# EAGLE design main_module (EAGLE 7.7.0)
CO2 Monitor main board
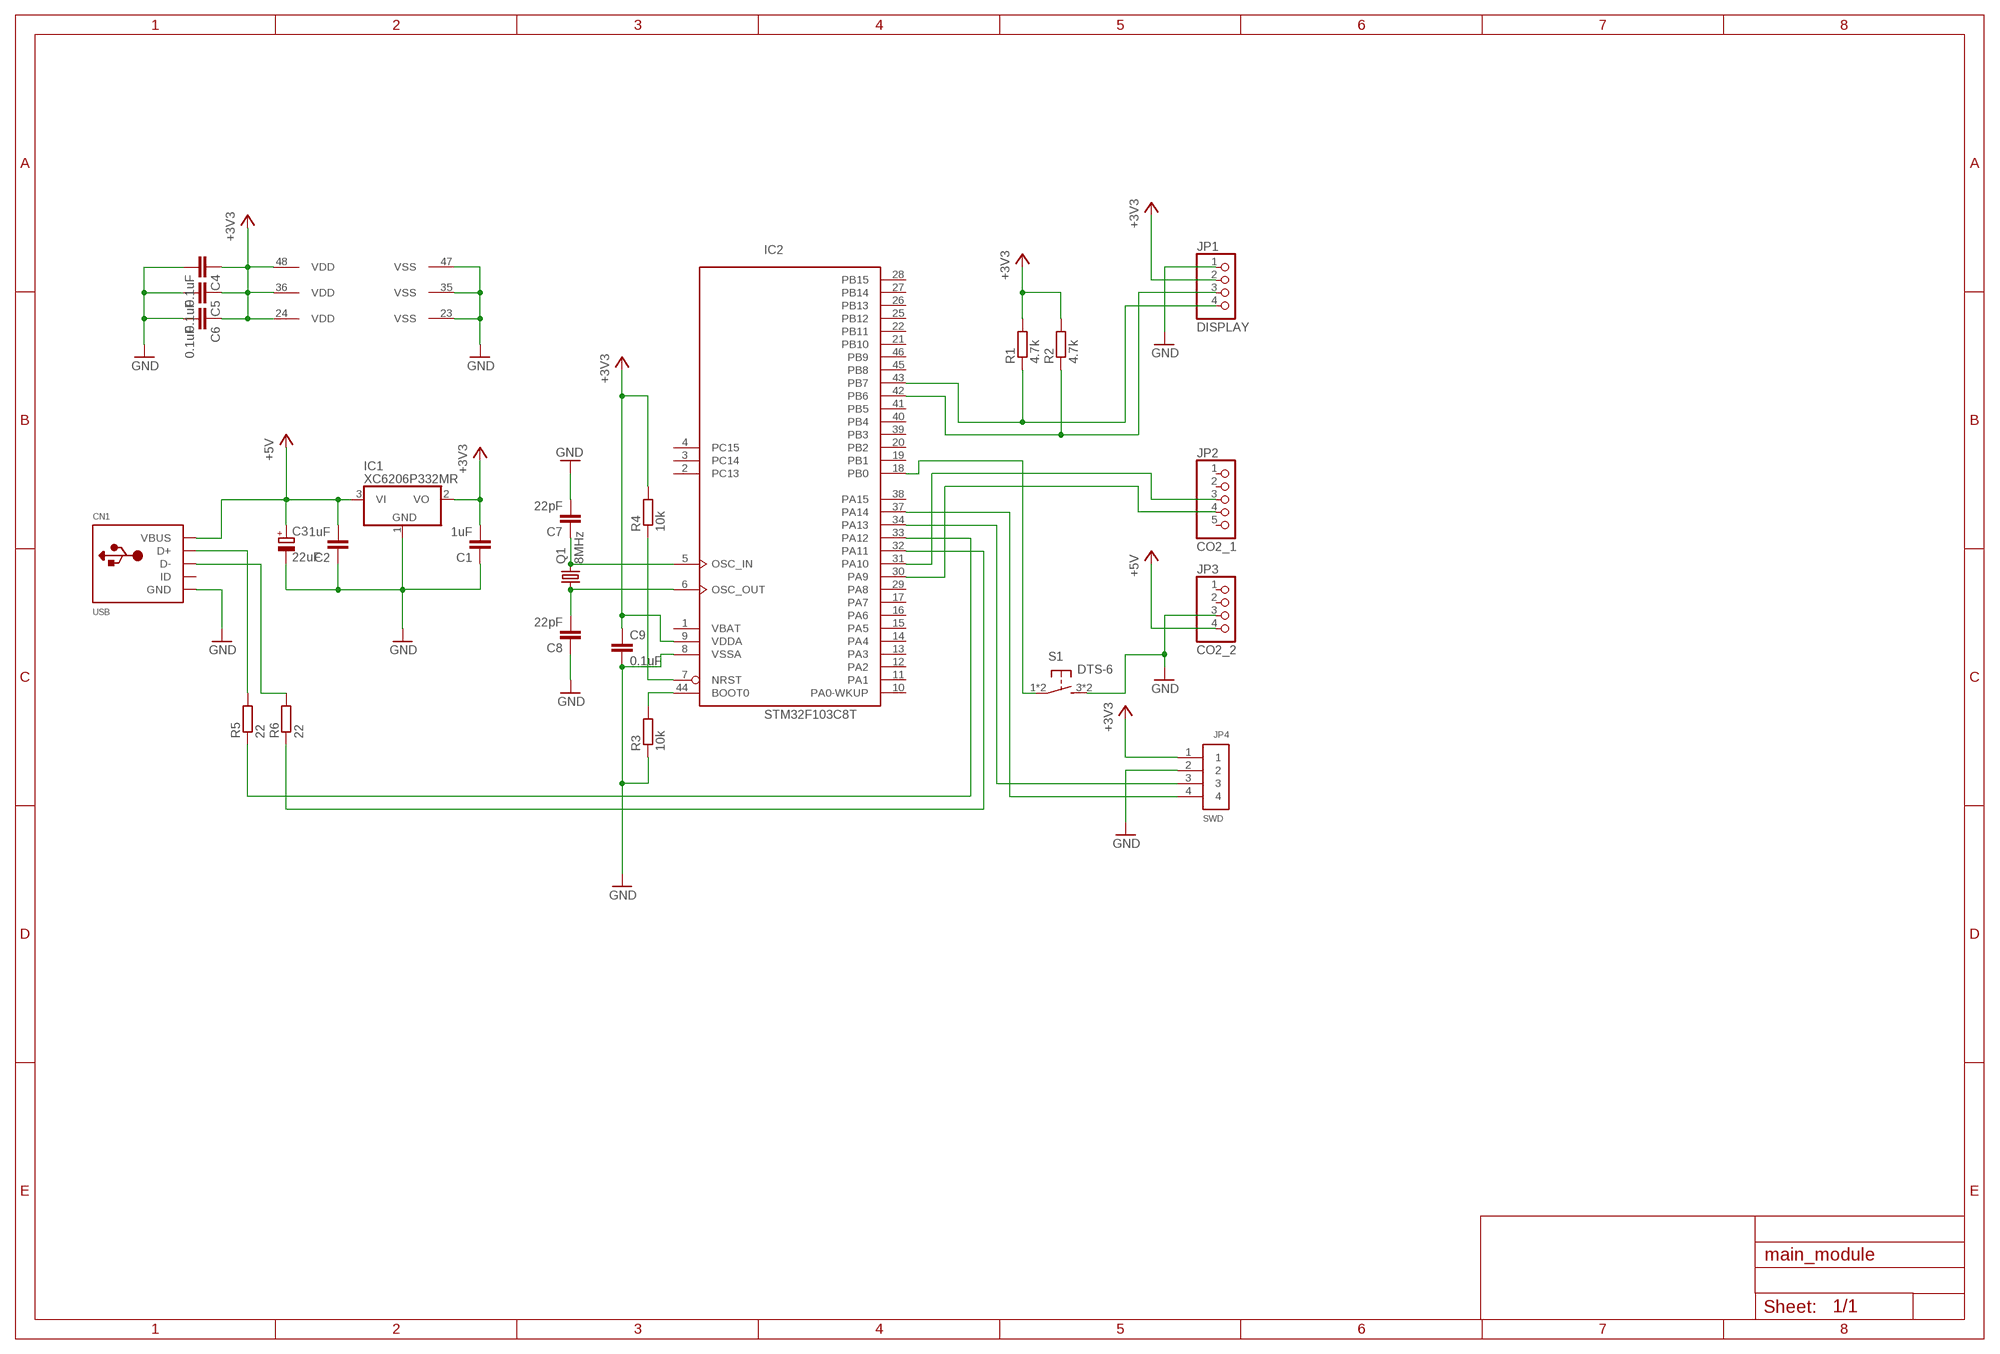
[diagram p0: schematic, sheet 1]

## Parts
C1  1uF  C-EUC0805  [C0805]
C2  1uF  C-EUC0805  [C0805]
C3  22uF  CPOL-EUC/6032-28R  [C/6032-28R]
C4  0.1uF  C-EUC0805  [C0805]
C5  0.1uF  C-EUC0805  [C0805]
C6  0.1uF  C-EUC0805  [C0805]
C7  22pF  C-EUC0805  [C0805]
C8  22pF  C-EUC0805  [C0805]
C9  0.1uF  C-EUC0805  [C0805]
CN1  USB  USBMINIB  [USB-MINIB]
IC1  XC6206P332MR  MCP1703CB  [SOT23]
IC2  STM32F103C8T  [LQFP48]
JP1  DISPLAY  PINHD-1X4  [1X04]
JP2  CO2_1  PINHD-1X5  [1X05]
JP3  CO2_2  PINHD-1X4  [1X04]
JP4  SWD  1X4-BIG  [1X04-BIG]
Q1  8MHz  CRYSTALHC49UP  [HC49UP]
R1  4.7k  R-EU_R0805  [R0805]
R2  4.7k  R-EU_R0805  [R0805]
R3  10k  R-EU_R0805  [R0805]
R4  10k  R-EU_R0805  [R0805]
R5  22  R-EU_R0805  [R0805]
R6  22  R-EU_R0805  [R0805]
S1  DTS-6  [DTS-6]

## Nets
+3V3: C1.2 C4.1 C5.1 C6.1 C9.1 IC1.2(VO) IC2.9(VDDA) IC2.24(VDD) IC2.36(VDD) IC2.48(VDD) JP1.2 JP4.1 R1.2 R2.2 R4.2
+5V: C2.2 C3.+ CN1.VBUS IC1.3(VI) JP3.4
GND: C1.1 C2.1 C3.- C4.2 C5.2 C6.2 C7.2 C8.1 C9.2 CN1.GND IC1.1(GND) IC2.8(VSSA) IC2.23(VSS) IC2.35(VSS) IC2.47(VSS) JP1.1 JP3.3 JP4.2 R3.1 S1.3 S1.4
N$1: C7.1 IC2.5(OSC_IN) Q1.2
N$2: IC2.44(BOOT0) R3.2
N$3: IC2.18(PB0) S1.1 S1.2
N$4: C8.2 IC2.6(OSC_OUT) Q1.1
N$5: IC2.7(NRST) R4.1
N$12: CN1.D+ R5.2
N$13: CN1.D- R6.2
RX: IC2.31(PA10) JP2.3
SCL: IC2.42(PB6) JP1.3 R2.1
SDA: IC2.43(PB7) JP1.4 R1.1
SWCLK: IC2.37(PA14) JP4.4
SWDIO: IC2.34(PA13) JP4.3
TX: IC2.30(PA9) JP2.4
USB_DM: IC2.32(PA11) R6.1
USB_DP: IC2.33(PA12) R5.1
Unconnected: CN1.ID IC2.2(PC13) IC2.3(PC14) IC2.4(PC15) IC2.10(PA0-WKUP) IC2.11(PA1) IC2.12(PA2) IC2.13(PA3) IC2.14(PA4) IC2.15(PA5) IC2.16(PA6) IC2.17(PA7) IC2.19(PB1) IC2.20(PB2) IC2.21(PB10) IC2.22(PB11) IC2.25(PB12) IC2.26(PB13) IC2.27(PB14) IC2.28(PB15) IC2.29(PA8) IC2.38(PA15) IC2.39(PB3) IC2.40(PB4) IC2.41(PB5) IC2.45(PB8) IC2.46(PB9) JP2.1 JP2.2 JP2.5 JP3.1 JP3.2

## Power pins joined to a net without a drawn wire
VBAT: IC2.1(VBAT)

## Library data of the parts
C1 C2 C4-C9 = resistor:C-EU: CAPACITOR, European symbol
C3 = resistor:CPOL-EU: POLARIZED CAPACITOR, European symbol
CN1 = adafruit:USB: USB Connectors USBMINIB - Surface Mount Female Mini-B USB Connector 4UConnector: 06564 By microbuilder.eu Thru-hole RA Female Mini-B USB Connector 4UConnector: 18732 By ladyada.net
IC1 = linear:MCP1703: 250 mA, 16V, Low Quiescent Current LDO Regulator Source: http://ww1.microchip.com/downloads/en/DeviceDoc/22049b.pdf
IC2 = micro-stm_v3:STM32F103C*T: ARM 32-bit Cortex™-M3 CPU 72 MHz maximum frequency 16 to 128 Kbytes of Flash memory 6 to 20 kbytes of SRAM 37 GPIOs 2.0 to 3.6 V application supply
JP1 JP3 = pinhead:PINHD-1X4: PIN HEADER
JP2 = pinhead:PINHD-1X5: PIN HEADER
JP4 = adafruit:1X4: 4-pin connector
Q1 = crystal:CRYSTAL: CRYSTAL; OC_FARNELL: unknown; OC_NEWARK: unknown
R1-R6 = resistor:R-EU_: RESISTOR, European symbol
S1 = switch-tact:DTS-6

## Net classes
0 default: clearance 0.152 mm
1 power: width 0.508 mm, clearance 0.152 mm to class 0, clearance 0.152 mm

## Board
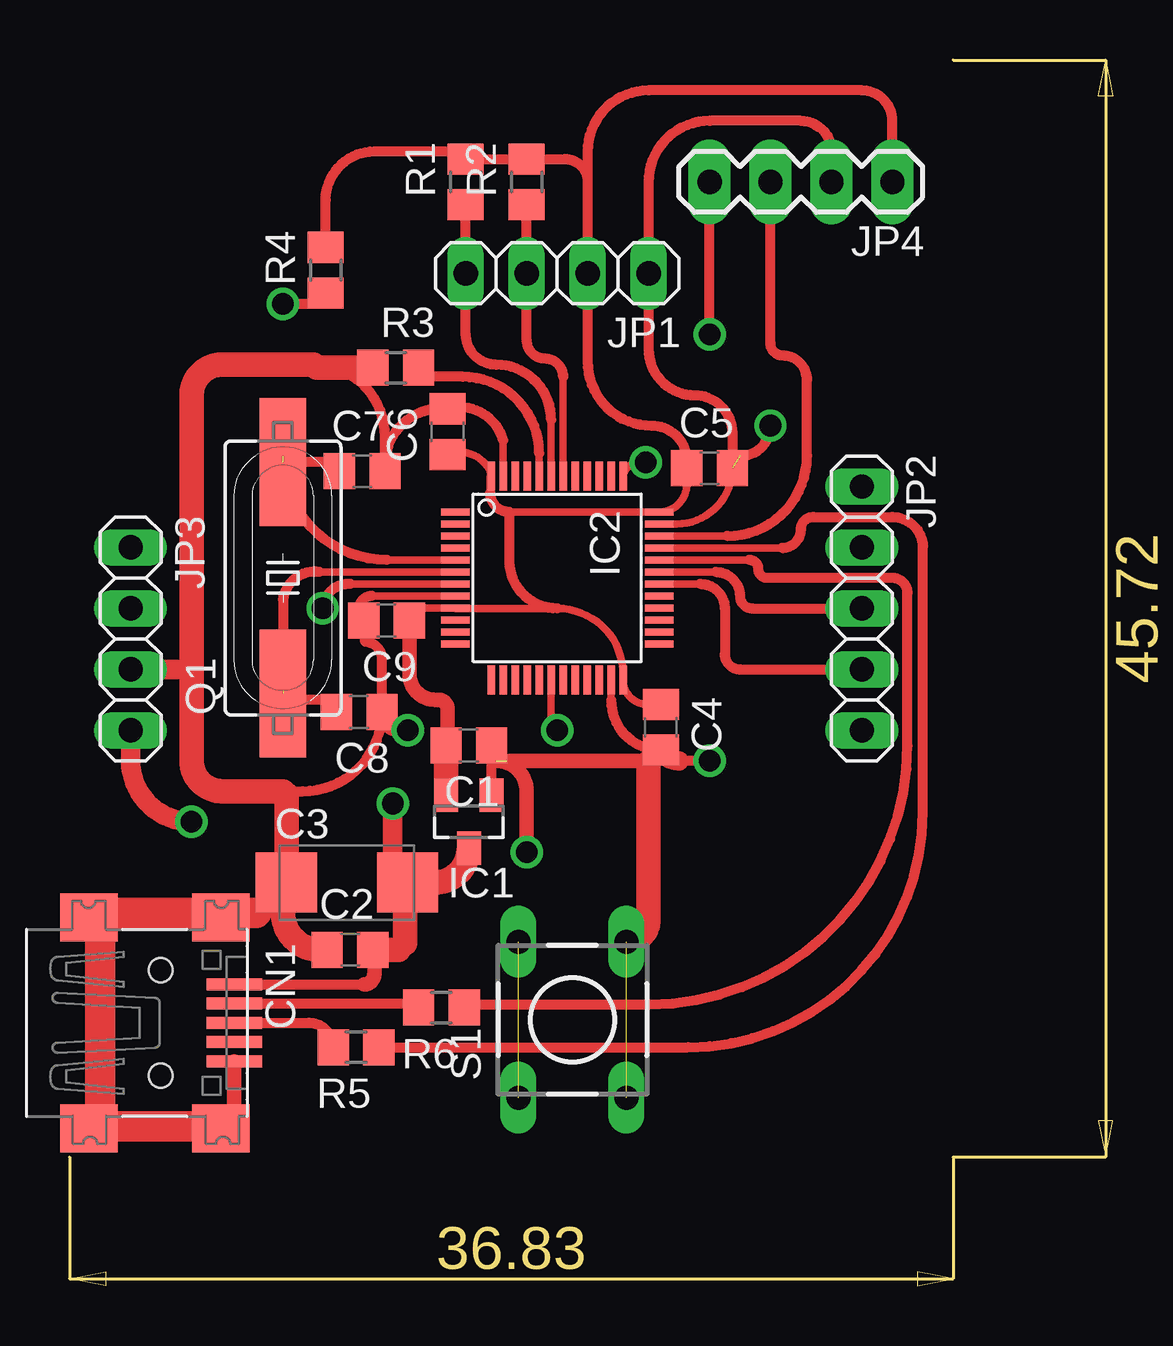
[diagram p1: board, top side]
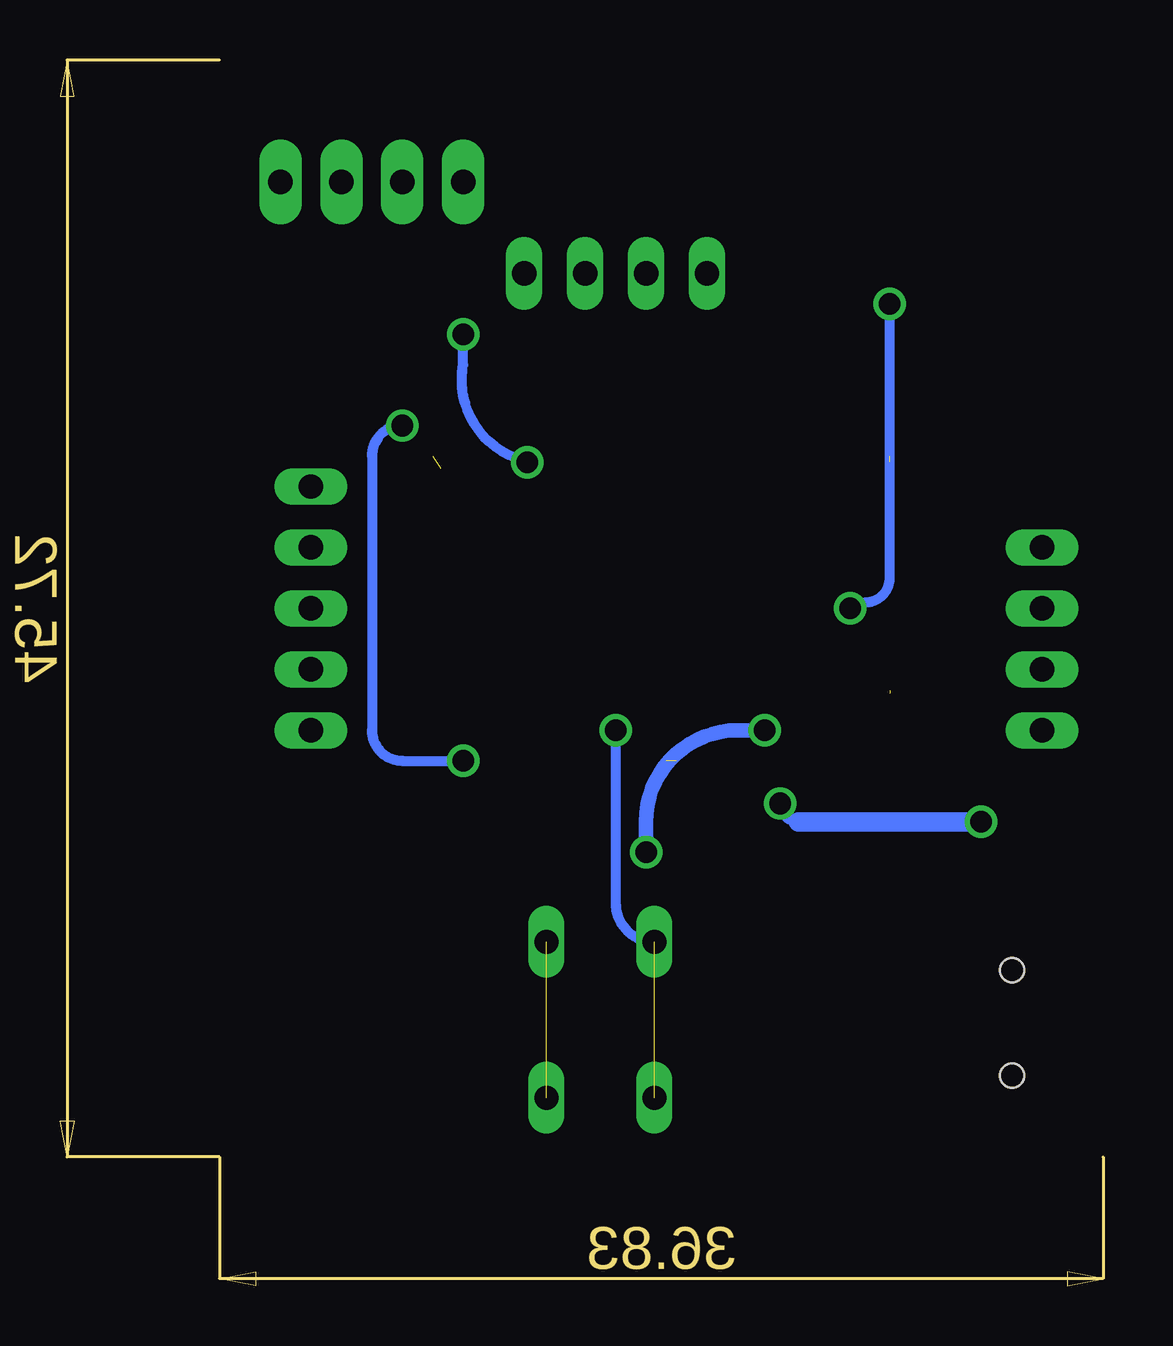
[diagram p2: board, bottom side, seen from below]

Size 43.48 x 51.1 mm. Coordinates in mm from the lower left corner, seen from the top.
Copper layers (1*16): Top 0.035mm / dielectric 1.5mm / Bottom 0.035mm
Design rules "default": minimum track width 10mil, minimum drill 24mil, track to track 8mil, track to pad 8mil, pad to pad 8mil, via to via 8mil, smd to smd 8mil, copper to edge 40mil, drill to drill 8mil, minimum pad ring 10mil, minimum via ring 8mil, stop-mask expansion 4mil, vias tented up to drill 0mil, thermal gap 10mil

### Footprints (pad centres in the part's own frame; a part is rotated, then mirrored left to right if it is on the bottom)
C0805 = smd 1.3 x 1.5: 1 -0.95,0; 2 0.95,0
C/6032-28R = smd 2.55 x 2.5: + 2.525,0; - -2.525,0
USB-MINIB = smd 0.5 x 2.308: D+ 0,4.064; D- -0.8,4.064; GND 1.6,4.064; ID 0.8,4.064; VBUS -1.6,4.064 | smd 2 x 2.4: GND1 -4.4,-2; GND2 -4.4,3.5; GND3 4.4,3.5; GND4 4.4,-2 | hole 1: -2.2,1; 2.2,1
SOT23 = smd 1 x 1.4: 1 -0.95,-1.1; 2 0.95,-1.1; 3 0,1.1
LQFP48 = smd 0.3 x 1.2: 1 -2.75,-4.25; 2 -2.25,-4.25; 3 -1.75,-4.25; 4 -1.25,-4.25; 5 -0.75,-4.25; 6 -0.25,-4.25; 7 0.25,-4.25; 8 0.75,-4.25; 9 1.25,-4.25; 10 1.75,-4.25; 11 2.25,-4.25; 12 2.75,-4.25; 25 2.75,4.25; 26 2.25,4.25; 27 1.75,4.25; 28 1.25,4.25; 29 0.75,4.25; 30 0.25,4.25; 31 -0.25,4.25; 32 -0.75,4.25; 33 -1.25,4.25; 34 -1.75,4.25; 35 -2.25,4.25; 36 -2.75,4.25 | smd 1.2 x 0.3: 13 4.25,-2.75; 14 4.25,-2.25; 15 4.25,-1.75; 16 4.25,-1.25; 17 4.25,-0.75; 18 4.25,-0.25; 19 4.25,0.25; 20 4.25,0.75; 21 4.25,1.25; 22 4.25,1.75; 23 4.25,2.25; 24 4.25,2.75; 37 -4.25,2.75; 38 -4.25,2.25; 39 -4.25,1.75; 40 -4.25,1.25; 41 -4.25,0.75; 42 -4.25,0.25; 43 -4.25,-0.25; 44 -4.25,-0.75; 45 -4.25,-1.25; 46 -4.25,-1.75; 47 -4.25,-2.25; 48 -4.25,-2.75
1X04 = drill 1.016 long: 1 -3.81,0; 2 -1.27,0; 3 1.27,0; 4 3.81,0
1X05 = drill 1.016 long: 1 -5.08,0; 2 -2.54,0; 3 0,0; 4 2.54,0; 5 5.08,0
1X04-BIG = drill 1.016 pad 1.778 long: 1 0,0; 2 2.54,0; 3 5.08,0; 4 7.62,0
HC49UP = smd 5.334 x 1.93: 1 -4.826,0; 2 4.826,0
R0805 = smd 1.3 x 1.5: 1 -0.95,0; 2 0.95,0
DTS-6 = drill 1 long: 1 -3.25,2.25; 2 3.25,2.25; 3 -3.25,-2.25; 4 3.25,-2.25

### Placement (x,y rotation side)
C1  16.64,22.52 180 top
C2  11.68,14.02 0 top
C3  11.56,16.81 0 top
C4  24.64,23.29 270 top
C5  26.67,34.08 0 top
C6  15.75,35.61 90 top
C7  12.19,33.95 0 top
C8  12.06,23.92 180 top
C9  13.21,27.73 180 top
CN1  2.79,10.97 270 top
IC1  16.64,19.35 180 top
IC2  20.32,29.51 270 top
JP1  20.32,42.21 180 top
JP2  33.02,28.24 270 top
JP3  2.54,26.97 270 top
JP4  34.29,46.02 180 top
Q1  8.89,29.51 90 top
R1  16.51,46.02 90 top
R2  19.05,46.02 90 top
R3  13.59,38.27 0 top
R4  10.67,42.34 90 top
R5  11.94,9.95 180 top
R6  15.49,11.6 180 top
S1  20.95,11.09 90 top

### Tracks (layer width: path | path; a pad name or v marks a point on that pad's centre or on a via)
+3V3
  Top 0.305: 25.72,33.41 arc-90 IC2.36 18.33,32.26 | C6.1 arc-90 17.57,33.85 IC2.48 arc90 17.53,33.72 17.53,33.07 | 24.09,24.24 arc-90 IC2.24 23.07,25.49 arc90 20.32,28.24 16.09,28.24 arc-90 IC2.9 14.05,28.26
  Top 0.406: 25.72,33.41 C5.1 25.72,34.4 arc90 24.26,35.86 arc-90 21.59,38.53 JP1.2 | 24.09,24.24 C4.1 | 14.05,28.26 arc90 C9.1 | 17.53,33.07 arc90 18.33,32.26 18.33,30.23 arc90 20.32,28.24 | JP1.2 21.59,46.02 arc90 20.64,46.97 R2.2 R1.2 arc90 16.19,47.29 12.7,47.29 arc90 10.67,45.26 R4.2 | JP4.1 34.29,48.56 arc90 33.02,49.83 24.13,49.83 arc90 21.59,47.29 JP1.2 | 15.24,24.43 15.37,24.43 | 15.75,22.59 arc-90 C1.2
  Top 0.61: C9.1 14.16,25.51 arc90 15.24,24.43 | 15.37,24.43 arc-90 15.75,24.05 15.75,22.59
  Top 1.016: IC1.2 C1.2
+5V  (via drill 0.9)
  Top 0.406: C3.+ 15.2,16.81 | 13.72,14.02 arc90 13.97,14.27 | 13.97,16.7 arc-90 C3.+ | CN1.VBUS 12.27,12.57 | 12.7,13.95 arc90 C2.2 | 13.46,17.43 arc90 C3.+
  Top 0.61: 12.27,12.57 arc90 12.7,13 12.7,13.95
  Top 0.813: JP3.4 2.54,21.89 arc90 v5.08,19.35 | v13.46,20.11 13.46,17.43
  Top 1.016: 15.2,16.81 arc90 IC1.3 | C2.2 13.72,14.02 | 13.97,14.27 13.97,16.7
  Bottom 0.406: 12.7,19.35 arc90 v13.46,20.11
  Bottom 0.813: v5.08,19.35 12.7,19.35
GND  (via drill 0.9)  (3 unrouted)
  Top 0.305: IC2.35 25.3,31.76 arc90 C5.2 | IC2.47 18.07,35.25 | IC2.23 22.57,24.4 | IC2.8 12.58,28.76
  Top 0.406: 18.07,35.25 arc90 C6.2 15.23,36.56 arc90 C7.2 13.14,35.42 arc90 10.16,38.4 arc90 10.29,38.27 | 22.57,24.4 arc90 C4.2 | 12.58,28.76 arc90 12.06,28.24 12.06,27.92 arc90 C9.2 arc-90 12.32,27.67 12.32,26.84 arc-90 13.01,26.15 C8.1 arc-90 9.71,20.62 8.89,20.62 arc-90 9.03,20.48 | C5.2 27.62,35.55 arc90 26.04,37.13 arc-90 24.13,39.03 JP1.1 24.13,46.02 arc-90 26.67,48.56 30.48,48.56 arc-90 31.75,47.29 JP4.2 | C4.2 24.58,22.34 arc90 24.13,21.89 | 18.22,21.89 arc-90 C1.1 | IC1.1 17.59,21.7 arc-90 17.78,21.89 | C2.1 10.41,14.02 | 8.89,15.54 8.89,16.67 arc-90 C3.- arc-90 7.76,15.54 | 6.86,7.16 arc-90 6.35,6.65 | 24.13,21.83 arc-90 C4.2 | 27.94,34.59 arc90 v29.21,35.86 | v26.67,21.89 25.4,21.89
  Top 0.61: 24.13,21.89 18.22,21.89 | CN1.GND 6.86,7.16 | 17.78,21.89 arc-90 19.05,20.62 v19.05,18.08 | v14.1,23.16 13.78,23.16 arc-90 C8.1
  Top 0.813: JP3.3 5.08,25.7 | 25.4,21.89 arc-61 C4.2
  Top 1.016: 10.16,38.4 6.35,38.4 arc90 5.08,37.13 5.08,25.7 5.08,21.89 arc90 6.35,20.62 8.89,20.62 | R3.1 10.29,38.27 | C3.- 9.03,20.48 | 10.41,14.02 arc-90 8.89,15.54 | 24.13,21.83 24.13,15.27 arc-90 S1.4
  Top 1.27: 6.35,6.65 1.27,6.65 1.27,15.54 7.76,15.54
  Bottom 0.406: v29.21,35.86 arc-90 30.48,34.59 30.48,23.16 arc-90 29.21,21.89 v26.67,21.89
  Bottom 0.61: v19.05,18.08 19.05,19.35 arc90 15.24,23.16 v14.1,23.16
N$1  (1 unrouted)
  Top 0.305: IC2.5 13.22,30.26
  Top 0.406: 13.22,30.26 arc-90 8.89,34.59 | C7.1 arc90 10.86,34.34 Q1.2
N$2
  Top 0.305: IC2.44 19.57,34.7
  Top 0.406: 19.57,34.7 arc90 16.38,37.89 14.67,37.89 arc-90 R3.2
N$3  (via drill 0.9)  (1 unrouted)
  Top 0.305: IC2.18 20.07,23.41
  Top 0.406: 20.07,23.41 arc90 v20.32,23.16
  Bottom 0.406: v20.32,23.16 20.32,15.96 arc-90 S1.2
N$4  (1 unrouted)
  Top 0.305: IC2.6 10.41,29.76
  Top 0.406: 10.41,29.76 arc90 8.89,28.62 8.89,24.81 8.89,24.43 10.61,24.43 arc-90 C8.2
N$5  (via drill 0.9)
  Top 0.305: IC2.7 11.69,29.26
  Top 0.406: 11.69,29.26 arc90 v10.54,28.24 | v8.89,40.94 10.22,40.94 arc90 R4.1
  Bottom 0.406: v10.54,28.24 9.91,28.49 arc-90 8.89,29.51 v8.89,40.94
N$12
  Top 0.406: CN1.D+ 9.97,10.97 arc-90 R5.2
N$13
  Top 0.406: CN1.D- 14.25,11.77 arc-90 R6.2
RX
  Top 0.305: IC2.31 26.93,29.76
  Top 0.406: 26.93,29.76 arc-90 27.94,28.75 arc90 28.45,28.24 JP2.3
SCL
  Top 0.305: IC2.42 20.57,37.9
  Top 0.406: 20.57,37.9 arc90 19.81,38.65 arc-90 19.05,39.42 JP1.3 R2.1
SDA
  Top 0.305: IC2.43 20.07,36.11
  Top 0.406: 20.07,36.11 arc90 17.78,38.4 arc-90 16.51,39.67 JP1.4 R1.1
SWCLK  (via drill 0.9)
  Top 0.305: IC2.37 23.07,33.78 arc-90 v24,34.34
  Top 0.406: v26.67,39.67 JP4.4
  Bottom 0.406: v24,34.34 23.88,34.34 arc90 26.67,38.4 v26.67,39.67
SWDIO
  Top 0.305: IC2.34 27.4,31.26
  Top 0.406: 27.4,31.26 arc90 30.73,34.59 30.73,37.77 arc90 29.72,38.78 arc-90 29.21,39.29 JP4.3
TX
  Top 0.305: IC2.30 26.29,29.26
  Top 0.406: 26.29,29.26 arc-90 27.3,28.24 27.3,26.33 arc90 27.94,25.7 JP2.4
USB_DM
  Top 0.305: 28.33,30.26 IC2.32
  Top 0.406: R6.1 16.44,11.66 arc-90 16.51,11.73 24.13,11.73 arc90 34.92,22.52 34.92,28.88 arc90 34.29,29.51 29.08,29.51 arc-90 28.7,29.89 arc90 28.33,30.26
USB_DP
  Top 0.305: IC2.33 29.7,30.76
  Top 0.406: 29.7,30.76 arc90 30.48,31.54 arc-90 30.99,32.05 34.29,32.05 arc-90 35.56,30.78 35.56,19.73 arc-90 25.78,9.95 R5.1